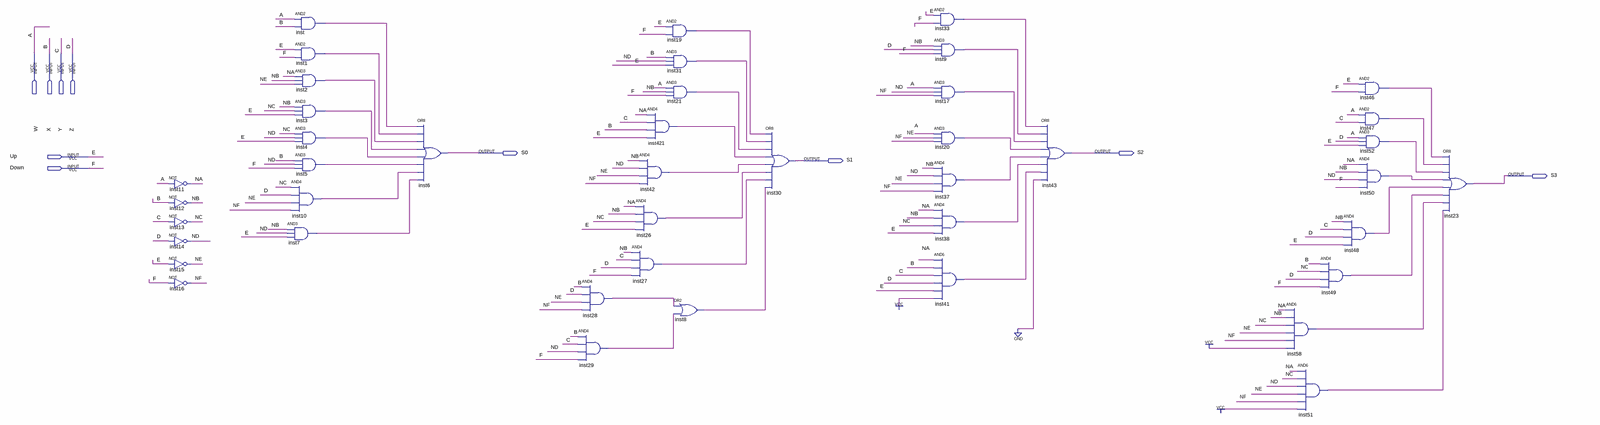
[diagram p0: schematic sheet, whole]
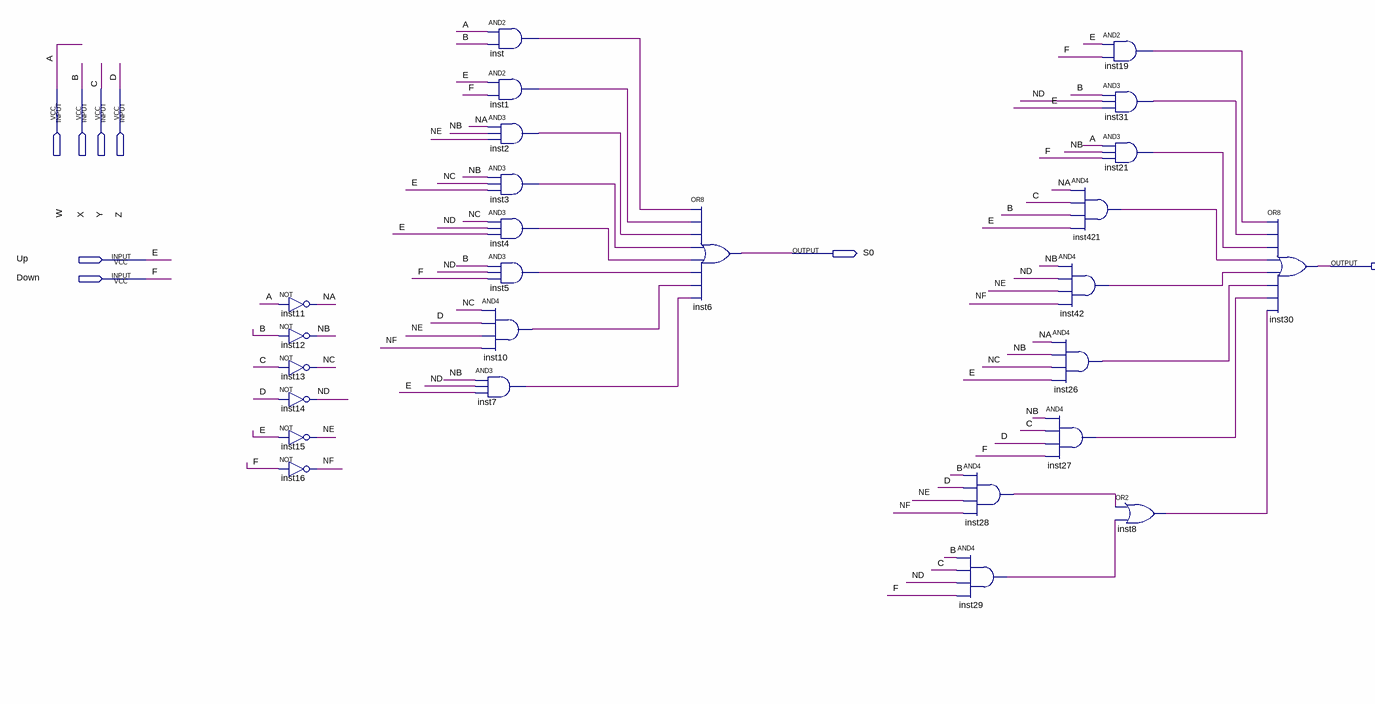
[diagram p1: schematic sheet, left part]
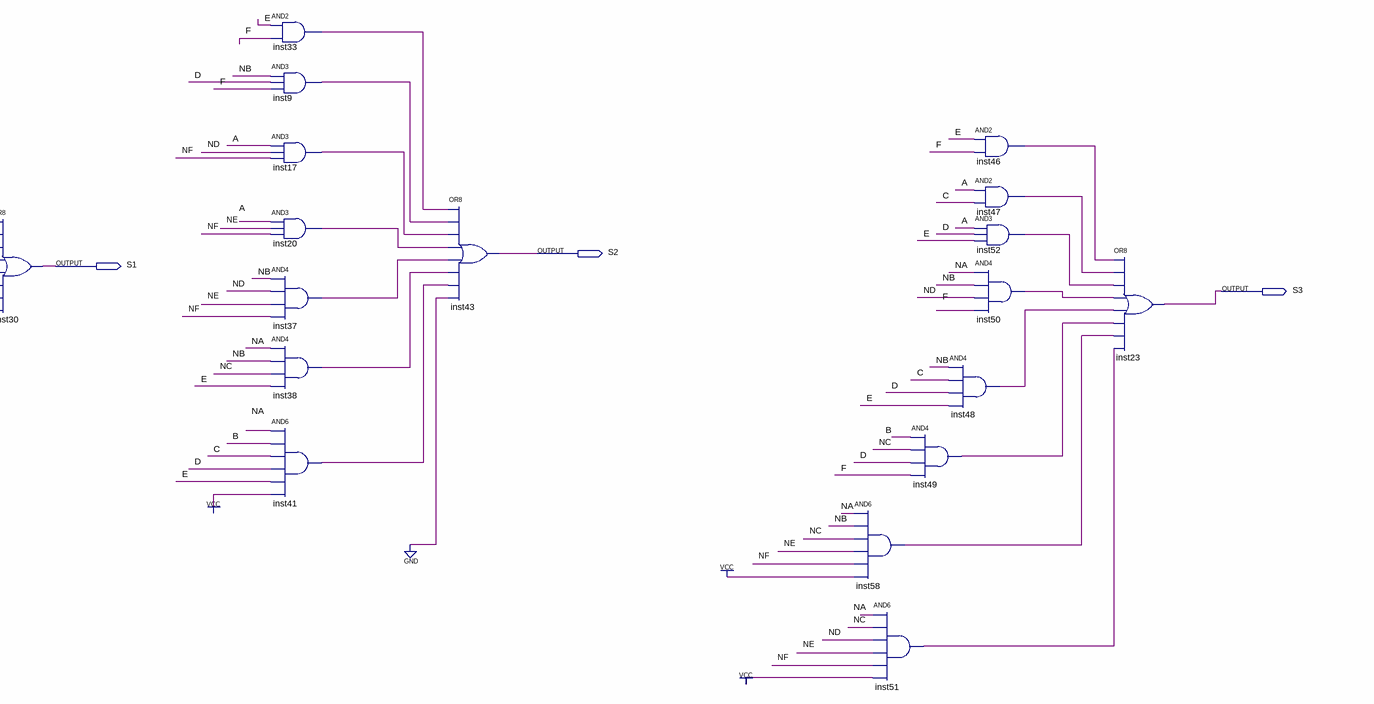
[diagram p2: schematic sheet, right part]
// Quartus schematic saida.bdf as structural Verilog: 43 symbols, 10 pins
module saida (
  input  W,
  input  X,
  input  Y,
  input  Z,
  input  Up,
  input  Down,
  output S0,
  output S2,
  output S1,
  output S3
);

  wire inst1_out, inst2_out, inst3_out, inst4_out, inst5_out, inst7_out, inst8_out, inst9_out, inst10_out,
       inst17_out, inst19_out, inst20_out, inst21_out, inst26_out, inst27_out, inst28_out, inst29_out,
       inst31_out, inst33_out, inst37_out, inst38_out, inst41_out, inst42_out, inst46_out, inst47_out,
       inst48_out, inst49_out, inst50_out, inst51_out, inst52_out, inst58_out, inst421_out, inst_out, NA, NB,
       NC, ND, NE, NF;

  not inst11 (NA, W);
  not inst12 (NB, X);
  not inst13 (NC, Y);
  not inst14 (ND, Z);
  not inst15 (NE, Up);
  not inst16 (NF, Down);
  and inst (inst_out, W, X);
  and inst1 (inst1_out, Up, Down);
  and inst2 (inst2_out, NA, NB, NE);
  and inst3 (inst3_out, NB, NC, Up);
  and inst4 (inst4_out, NC, ND, Up);
  and inst5 (inst5_out, X, ND, Down);
  and inst10 (inst10_out, NC, Z, NE, NF);
  and inst7 (inst7_out, NB, ND, Up);
  or inst6 (S0, inst_out, inst1_out, inst2_out, inst3_out, inst4_out, inst5_out, inst10_out, inst7_out);
  and inst28 (inst28_out, X, Z, NE, NF);
  and inst29 (inst29_out, X, Y, ND, Down);
  and inst26 (inst26_out, NA, NB, NC, Up);
  and inst27 (inst27_out, NB, Y, Z, Down);
  and inst19 (inst19_out, Up, Down);
  and inst31 (inst31_out, X, ND, Up);
  and inst21 (inst21_out, W, NB, Down);
  and inst421 (inst421_out, NA, Y, X, Up);
  and inst42 (inst42_out, NB, ND, NE, NF);
  or inst8 (inst8_out, inst28_out, inst29_out);
  or inst30 (S1, inst19_out, inst31_out, inst21_out, inst421_out, inst42_out, inst26_out, inst27_out, inst8_out);
  and inst33 (inst33_out, Up, Down);
  and inst9 (inst9_out, NB, Z, Down);
  and inst17 (inst17_out, W, ND, NF);
  and inst20 (inst20_out, W, NE, NF);
  and inst37 (inst37_out, NB, ND, NE, NF);
  and inst38 (inst38_out, NA, NB, NC, Up);
  and inst41 (inst41_out, NA, X, Y, Z, Up, 1'b1);
  or inst43 (S2, inst33_out, inst9_out, inst17_out, inst20_out, inst37_out, inst38_out, inst41_out, 1'b0);
  and inst58 (inst58_out, NA, NB, NC, NE, NF, 1'b1);
  and inst51 (inst51_out, NA, NC, ND, NE, NF, 1'b1);
  and inst49 (inst49_out, X, NC, Z, Down);
  and inst46 (inst46_out, Up, Down);
  and inst47 (inst47_out, W, Y);
  and inst52 (inst52_out, W, Z, Up);
  and inst50 (inst50_out, NA, NB, ND, Down);
  and inst48 (inst48_out, NB, Y, Z, Up);
  or inst23 (S3, inst46_out, inst47_out, inst52_out, inst50_out, inst48_out, inst49_out, inst58_out, inst51_out);

  // Other names for the same wires on the sheet: A = W; B = X; C = Y; D = Z; E = Up; F = Down
endmodule
